# Altium schematic sheet PWR_F2.SchDoc
size A3; Organization: Altium Limited; Address1: L3, 12a Rodborough Rd; Address2: Frenchs Forest; Address3: NSW; Address4: Australia 2086
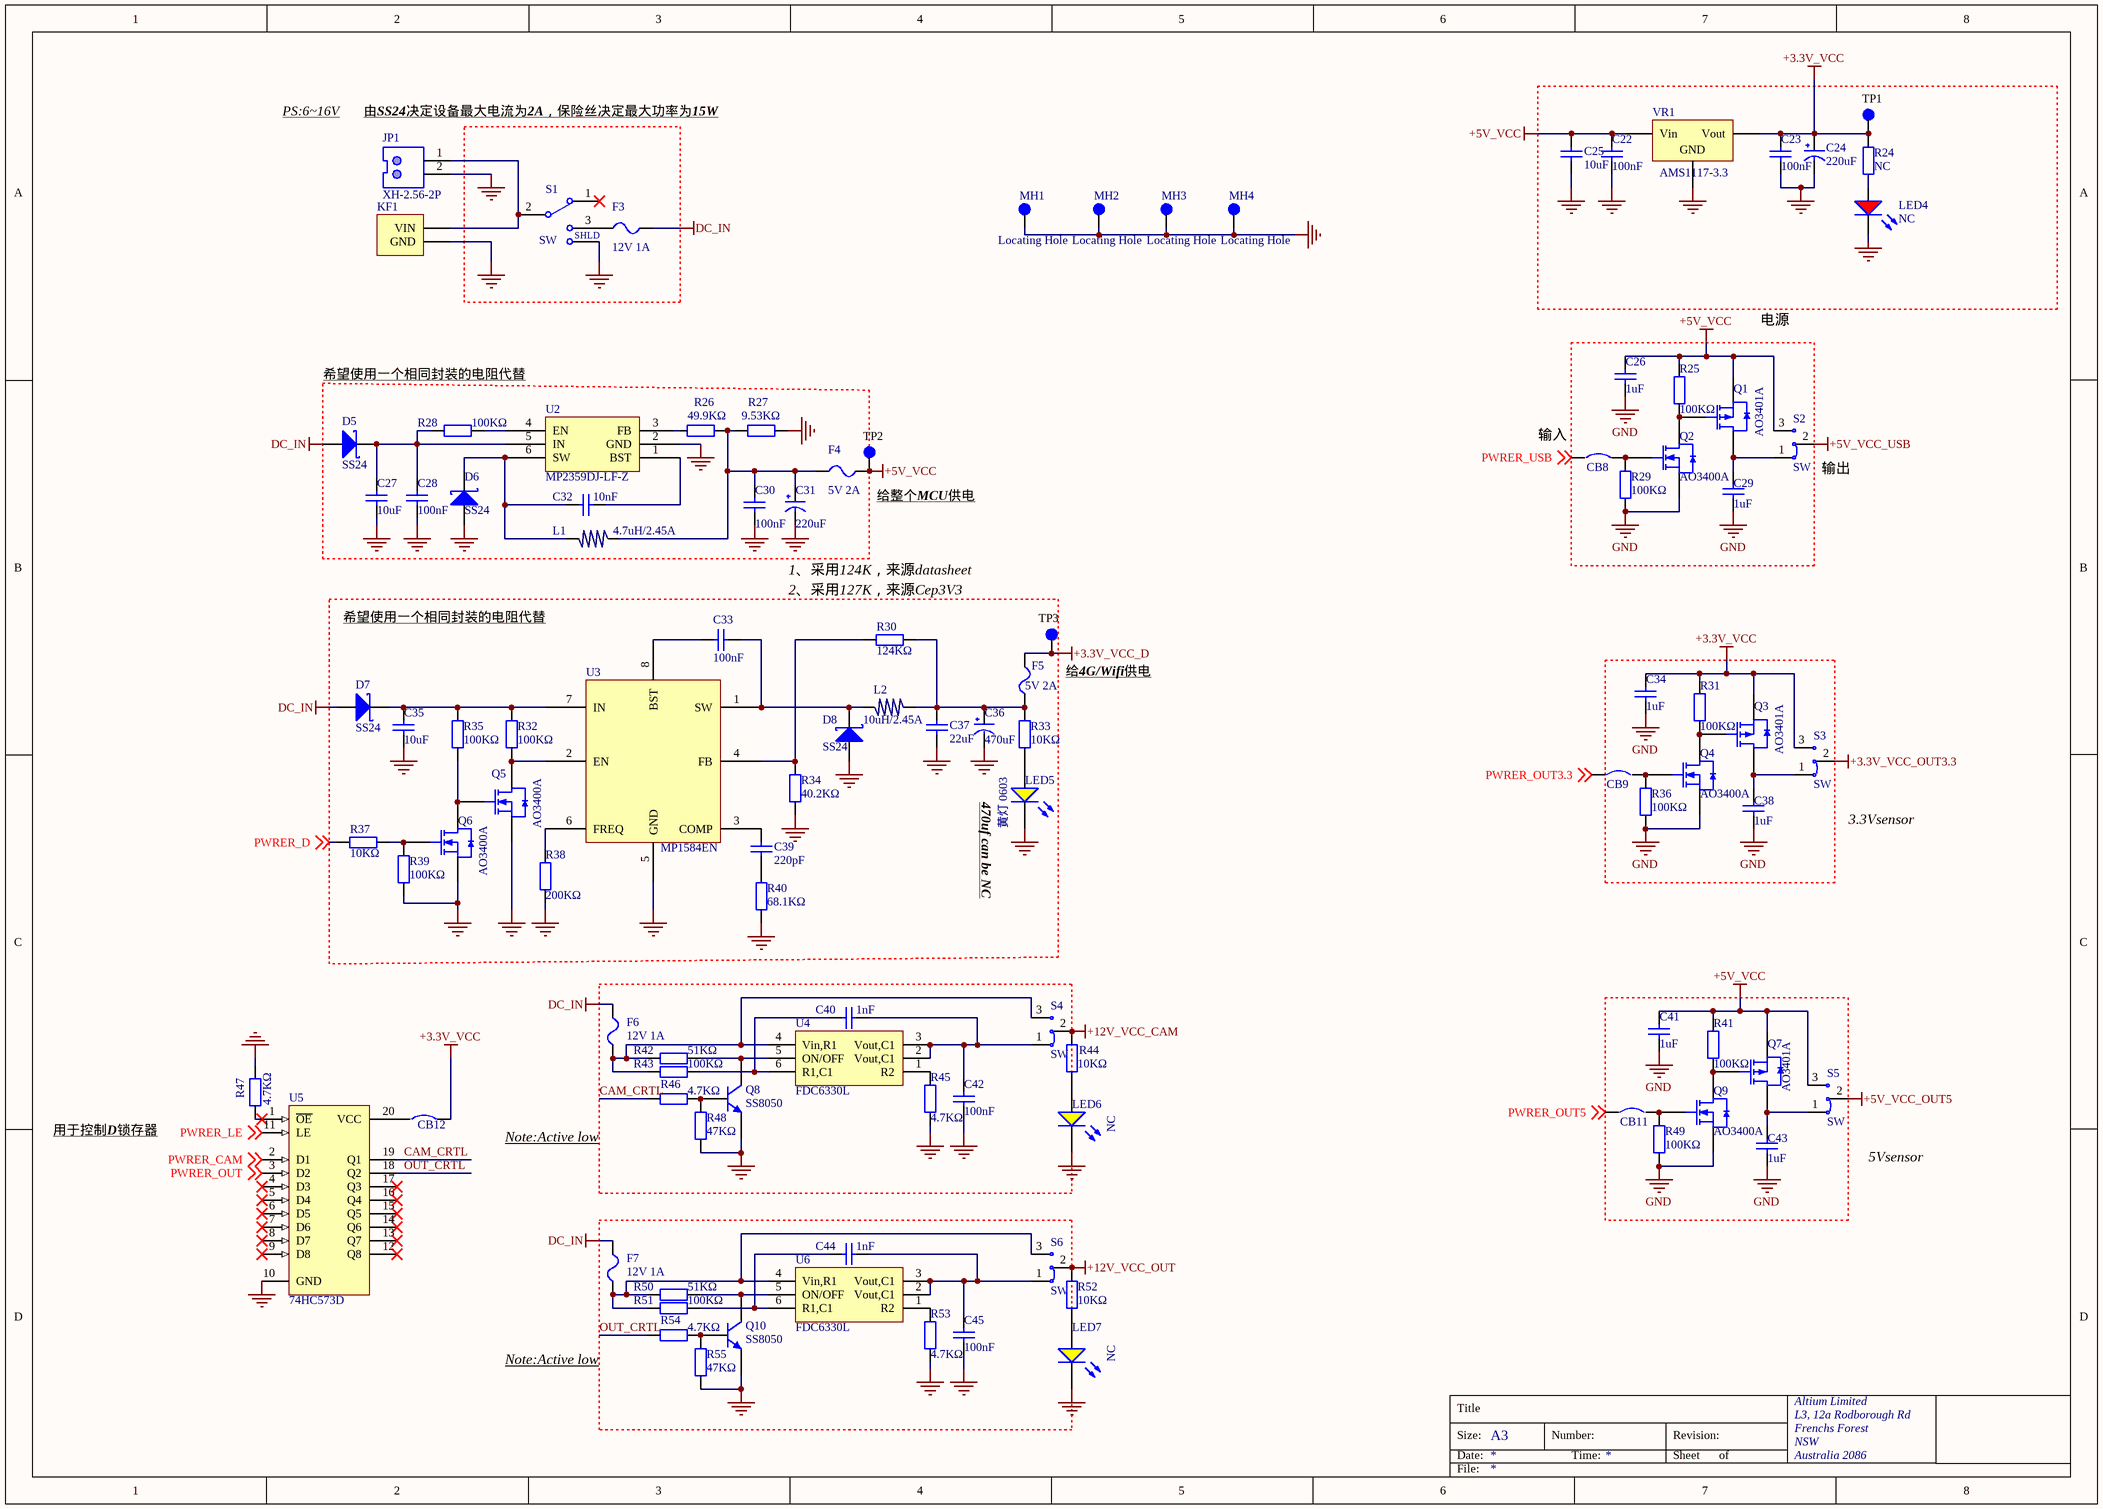
[diagram p0: PWR_F2.SchDoc]

## Parts
C22  100nF  [0603_C]
C23  100nF  [0603_C]
C24  220uF  [CT 6*6 - C]
C25  10uF  [0805_C]
C26  1uF  [0603_C]
C27  10uF  [0805_C]
C28  100nF  [0603_C]
C29  1uF  [0603_C]
C30  100nF  [0603_C]
C31  220uF  [CT 6*6 - C]
C32  10nF  [0603_C]
C33  100nF  [0603_C]
C34  1uF  [0603_C]
C35  10uF  [1206_C]
C36  470uF  [CT 8*7 - C]
C37  22uF  [0805_C]
C38  1uF  [0603_C]
C39  220pF  [0603_C]
C40  1nF  [0603_C]
C41  1uF  [0603_C]
C42  100nF  [0603_C]
C43  1uF  [0603_C]
C44  1nF  [0603_C]
C45  100nF  [0603_C]
CB8  CB  [CW]  (value not drawn)  (no BOM)
CB9  CB  [CW]  (value not drawn)  (no BOM)
CB11  CB  [CW]  (value not drawn)  (no BOM)
CB12  CB  [CW]  (value not drawn)  (no BOM)
D5  SS24  [SMA(DO-214AC)_S1]
D6  SS24  [SMA(DO-214AC)_S1]
D7  SS24  [SMA(DO-214AC)_S1]
D8  SS24  [SMA(DO-214AC)_S1]
F3  12V 1A  [FU 0805]
F4  5V 2A  [FU 0805]
F5  5V 2A  [FU 0805]
F6  12V 1A  [FU 0805]
F7  12V 1A  [FU 0805]
JP1  XH-2.56-2P  [XH2.54-2P]
KF1  DC  [KF2EDGK-2.54-LI-2P]  (value not drawn)
L1  4.7uH/2.45A  [L_0630]
L2  10uH/2.45A  [L_0630]
LED4  NC  [0603_LED_S1]
LED5  黄灯 0603  [0603_LED_S1]
LED6  NC  [0603_LED_S1]
LED7  NC  [0603_LED_S1]
MH1  Locating Hole  [lh]
MH2  Locating Hole  [lh]
MH3  Locating Hole  [lh]
MH4  Locating Hole  [lh]
Q1  AO3401A  [SOT-23-3L]
Q2  AO3400A  [SOT-23-3L]
Q3  AO3401A  [SOT-23-3L]
Q4  AO3400A  [SOT-23-3L]
Q5  AO3400A  [SOT-23-3L]
Q6  AO3400A  [SOT-23-3L]
Q7  AO3401A  [SOT-23-3L]
Q8  SS8050  [SOT-23(SOT-23-3)]
Q9  AO3400A  [SOT-23-3L]
Q10  SS8050  [SOT-23(SOT-23-3)]
R24  NC  [0603_R]
R25  100KΩ  [0603_R]
R26  49.9KΩ  [0603_R]
R27  9.53KΩ  [0603_R]
R28  100KΩ  [0603_R]
R29  100KΩ  [0603_R]
R30  124KΩ  [0603_R]
R31  100KΩ  [0603_R]
R32  100KΩ  [0603_R]
R33  10KΩ  [0402_R]
R34  40.2KΩ  [0603_R]
R35  100KΩ  [0603_R]
R36  100KΩ  [0603_R]
R37  10KΩ  [0603_R]
R38  200KΩ  [0603_R]
R39  100KΩ  [0603_R]
R40  68.1KΩ  [0603_R]
R41  100KΩ  [0603_R]
R42  51KΩ  [0603_R]
R43  100KΩ  [0603_R]
R44  10KΩ  [0603_R]
R45  4.7KΩ  [0603_R]
R46  4.7KΩ  [0603_R]
R47  4.7KΩ  [0603_R]
R48  47KΩ  [0603_R]
R49  100KΩ  [0603_R]
R50  51KΩ  [0603_R]
R51  100KΩ  [0603_R]
R52  10KΩ  [0603_R]
R53  4.7KΩ  [0603_R]
R54  4.7KΩ  [0603_R]
R55  47KΩ  [0603_R]
S1  SW  [SS-12F23 (1P2T)  Straight foot]
S2  SW  [SWITCH_SPOT]
S3  SW  [SWITCH_SPOT]
S4  SW  [SWITCH_SPOT]
S5  SW  [SWITCH_SPOT]
S6  SW  [SWITCH_SPOT]
TP1  TP  [TP-SM-C-100-PIN]  (value not drawn)
TP2  TP  [TP-SM-C-100-PIN]  (value not drawn)
TP3  TP  [TP-SM-C-100-PIN]  (value not drawn)
U2  MP2359DJ-LF-Z  [SOT-23-6]
U3  MP1584EN  [SOIC-8_EP_150mil]
U4  FDC6330L  [SOT-23-6]
U5  74HC573D  [SSOP-20_208mil]
U6  FDC6330L  [SOT-23-6]
VR1  AMS1117-3.3  [SOT-223]

## Blocks framed on the sheet
电源: C26 C29 CB8 Q1 Q2 R25 R29 S2
希望使用一个相同封装的电阻代替: C27 C28 C30-C32 D5 D6 F4 L1 R26-R28 U2
2、采用127K，来源Cep3V3: C33 C35-C37 C39 D7 D8 F5 L2 LED5 Q5 Q6 R30 R32-R35 R37-R40 TP3 U3

## Nets
+3.3V_VCC: C23.2 C24.1(VCC) C34.2 CB12.2 Q3.2(S) R24.2 R31.2 S3.3 TP1.1 VR1.2(Vout)
+3.3V_VCC_D: F5.2 TP3.1
+3.3V_VCC_OUT3.3: S3.2
+5V_VCC: C22.2 C25.2 C26.2 C41.2 F4.2 Q1.2(S) Q7.2(S) R25.2 R41.2 S2.3 S5.3 TP2.1 VR1.3(Vin)
+5V_VCC_OUT5: S5.2
+5V_VCC_USB: S2.2
+12V_VCC_CAM: R44.2 S4.2
+12V_VCC_OUT: R52.2 S6.2
DC_IN: D5.1(A) D7.1(A) F3.2 F6.2 F7.2
GND: C22.1 C23.1 C24.2(GND) C25.1 C26.1 C27.2 C28.1 C29.1 C30.2 C31.2(GND) C34.1 C35.2 C36.2(GND) C37.1 C38.1 C41.1 C42.1 C43.1 C45.1 D6.1(A) D8.1(A) JP1.2 KF1.2(GND) LED4.K LED5.K LED6.K LED7.K MH1.1 MH2.1 MH3.1 MH4.1 Q2.2(S) Q4.2(S) Q5.2(S) Q6.2(S) Q8.2(E) Q9.2(S) Q10.2(E) R27.2 R29.1 R34.1 R36.1 R38.2 R39.1 R40.1 R45.2 R47.2 R48.2 R49.1 R53.2 R55.2 S1.0(shield) U2.2(GND) U3.5(GND) U5.10(GND) VR1.1(GND)
CAM_CRTL: R46.1 U5.19(Q1)
OUT_CRTL: R54.1 U5.18(Q2)
PWRER_CAM: U5.2(D1) ; off-sheet PWRER_CAM
PWRER_D: R37.1 ; off-sheet PWRER_D
PWRER_LE: U5.11(LE) ; off-sheet PWRER_LE
PWRER_OUT: U5.3(D2) ; off-sheet PWRER_OUT
PWRER_OUT3.3: CB9.1 ; off-sheet PWRER_OUT3.3
PWRER_OUT5: CB11.1 ; off-sheet PWRER_OUT5
PWRER_USB: CB8.1 ; off-sheet PWRER_USB
NetC27_1: C27.1 C28.2 D5.2(K) R28.2 U2.5(IN)
NetC29_2: C29.2 Q1.3(D) S2.1
NetC30_1: C30.1 C31.1(VCC) F4.1 L1.1 R26.1 R27.1
NetC32_1: C32.1 U2.1(BST)
NetC32_2: C32.2 D6.2(K) L1.2 U2.6(SW)
NetC33_1: C33.1 U3.8(BST)
NetC33_2: C33.2 D8.2(K) L2.1 U3.1(SW)
NetC35_1: C35.1 D7.2(K) R32.1 R35.1 U3.7(IN)
NetC36_1: C36.1(VCC) C37.2 F5.1 L2.2 R30.2 R33.2
NetC38_2: C38.2 Q3.3(D) S3.1
NetC39_1: C39.1 R40.2
NetC39_2: C39.2 U3.3(COMP)
NetC40_1: C40.1 C42.2 S4.1 U4.2(Vout,C1) U4.3(Vout,C1)
NetC40_2: C40.2 R43.1 U4.6(R1,C1)
NetC43_2: C43.2 Q7.3(D) S5.1
NetC44_1: C44.1 C45.2 S6.1 U6.2(Vout,C1) U6.3(Vout,C1)
NetC44_2: C44.2 R51.1 U6.6(R1,C1)
NetCB8_2: CB8.2 Q2.1(G) R29.2
NetCB9_2: CB9.2 Q4.1(G) R36.2
NetCB11_2: CB11.2 Q9.1(G) R49.2
NetCB12_1: CB12.1 U5.20(VCC)
NetF3_1: F3.1 S1.3
NetF6_1: F6.1 R42.2 R43.2 S4.3 U4.4(Vin,R1)
NetF7_1: F7.1 R50.2 R51.2 S6.3 U6.4(Vin,R1)
NetJP1_1: JP1.1 KF1.1(VIN) S1.2
NetLED4_A: LED4.A R24.1
NetLED5_A: LED5.A R33.1
NetLED6_A: LED6.A R44.1
NetLED7_A: LED7.A R52.1
NetQ1_1: Q1.1(G) Q2.3(D) R25.1
NetQ3_1: Q3.1(G) Q4.3(D) R31.1
NetQ5_1: Q5.1(G) Q6.3(D) R35.2
NetQ5_3: Q5.3(D) R32.2 U3.2(EN)
NetQ6_1: Q6.1(G) R37.2 R39.2
NetQ7_1: Q7.1(G) Q9.3(D) R41.1
NetQ8_1: Q8.1(B) R46.2 R48.1
NetQ8_3: Q8.3(C) R42.1 U4.5(ON/OFF)
NetQ10_1: Q10.1(B) R54.2 R55.1
NetQ10_3: Q10.3(C) R50.1 U6.5(ON/OFF)
NetR26_2: R26.2 U2.3(FB)
NetR28_1: R28.1 U2.4(EN)
NetR30_1: R30.1 R34.2 U3.4(FB)
NetR38_1: R38.1 U3.6(FREQ)
NetR45_1: R45.1 U4.1(R2)
NetR47_1: R47.1 U5.1(~{OE})
NetR53_1: R53.1 U6.1(R2)

Not connected (* = marked no-connect by the designer): S1 1*; U5 4(D3)* 5(D4)* 6(D5)* 7(D6)* 8(D7)* 9(D8)* 12(Q8)* 13(Q7)* 14(Q6)* 15(Q5)* 16(Q4)* 17(Q3)*

## Notes on the sheet
- PS:6~16V
- (near JP1) 由SS24决定设备最大电流为2A，保险丝决定最大功率为15W
- (near CB8) 输入
- 给整个MCU供电
- (near S2) 输出
- 1、采用124K，来源datasheet
- 希望使用一个相同封装的电阻代替
- 给4G/Wifi供电
- (near LED5) 470uf can be NC
- (near S3) 3.3Vsensor
- 用于控制D锁存器
- Note:Active low
- 5Vsensor
- Title
- Size:
- Date:
- A3
- Number:
- Time:
- Revision:
- Sheet
- of
- File:
- *
- (in symbol SW SSW-1P_2) SHLD

## Library data of the parts
C22 C23 C28 C30 C33 C42 C45 = Cap 0603 100nF (104) 10% 50V: 贴片电容; ComponentLink1Description: 供应商链接; ComponentLink1URL: http://www.szlcsc.com/product/details_15331.html; Package: 0603; Supplier: LC; SuppliersPartNumber: C14663
C24 C31 = Cap+ CT6.3*5.4 220uF/16V: 电解电容
C25 C27 = Cap 0805 10uF (106) 10% 25V: 贴片电容; ComponentLink1Description: 供应商链接; ComponentLink1URL: http://www.szlcsc.com/product/details_16532.html; Package: 0805; Supplier: LC; SuppliersPartNumber: C15850; Value: 10uF
C26 C29 C34 C38 C41 C43 = Cap 0603 1uF (105) 10% 50V: 贴片电容; ComponentLink1Description: 供应商链接; ComponentLink1URL: http://www.szlcsc.com/product/details_16531.html; Package: 0603; Supplier: LC; SuppliersPartNumber: C15849
C32 = Cap 0603 10nF (103) 10% 50V: 贴片电容; ComponentLink1Description: 供应商链接; ComponentLink1URL: http://www.szlcsc.com/product/details_58143.html; Package: 0603; Supplier: LC; SuppliersPartNumber: C57112
C35 = Cap 1206 10uF (106) 10% 50V: 贴片电容; ComponentLink1Description: 供应商链接; ComponentLink1URL: http://www.szlcsc.com/product/details_14236.html; Package: 1206; Supplier: LC; SuppliersPartNumber: C13585
C36 = Cap+ CT8*10.2 470uF/16V: 电解电容
C37 = Cap 0805 22uF (226) 20% 25V: 贴片电容; ComponentLink1Description: 供应商链接; ComponentLink1URL: http://www.szlcsc.com/product/details_46786.html; Package: 0805; Supplier: LC; SuppliersPartNumber: C45783
C39 = Cap 0603 220pF (221) 10% 50V: 贴片电容; ComponentLink1Description: 供应商链接; ComponentLink1URL: http://www.szlcsc.com/product/details_1955.html; Package: 0603; Supplier: LC; SuppliersPartNumber: C1603
C40 C44 = Cap 0603 1nF (102) 10% 50V: 贴片电容; ComponentLink1Description: 供应商链接; ComponentLink1URL: http://www.szlcsc.com/product/details_1940.html; Package: 0603; Supplier: LC; SuppliersPartNumber: C1588
CB8 CB9 CB11 CB12 = Circuit Breaker: Published: 24-Mar-1999; LatestRevisionDate: 17-Jul-2002; LatestRevisionNote: Re-released for DXP Platform.; PackageReference: SPST-2; Publisher: Altium Limited
D5-D8 = SMA(DO-214AC) SS24: 肖特基二极管; ComponentLink1Description: 供应商链接; ComponentLink1URL: http://www.szlcsc.com/product/details_23178.html; Package: SMA(DO-214AC); Supplier: LC; SuppliersPartNumber: C22452
F3 F6 F7 = FU PPTC MSMD 12V 1A: 自恢复保险丝; BOM名称: 贴片保险丝; 版权归属: 源创客; 学习资源: www.ooocke.com
F4 F5 = FU PPTC MSMD 5V 2A: 自恢复保险丝; BOM名称: 贴片保险丝; 版权归属: 源创客; 学习资源: www.ooocke.com
JP1 = Header XH-2.56-2P: Male Header, Pitch 2.5 mm, 1 x 2 Position, Height 7 mm, Tail Length 3.4 mm, -25 to 85 degC, RoHS, Bulk; Manufacturer: JST; No of Positions: 2; Pitch: 2.5mm; Style/Orientation: StraightHeader/Plug; Datasheet Version: 05/2016; Package Description: Male Header, Pitch 2.5 mm, 1 x 2 Position, Height 7 mm, Tail Length 3.4 mm; Package Reference: B2B-XH-A; Mounting Technology: ThroughHole; Type: ShroudedHeader; Datasheet URL: http://www.jst-mfg.com/product/pdf/eng/eXH.pdf; Manufacturer URL: http://www.jst.com/home2.html; Termination: Crimp
KF1 = KF2EDGK-2.54-2P: 2P, DC,KF2EDGK-2.54
L1 = IUD 0630-4.7uH/2.45A 10%: 一体成型贴片电感; Value: 10uH/2.45A; ComponentLink1Description: 供应商链接; ComponentLink1URL: http://www.szlcsc.com/product/details_12684.html
L2 = IUD 0630-10uH/2.45A 10%: 一体成型贴片电感; ComponentLink1Description: 供应商链接; ComponentLink1URL: http://www.szlcsc.com/product/details_12684.html; Value: 10uH/2.45A
LED4 = LED 0603 红灯: 发光二极管; ComponentLink1Description: 供应商链接; ComponentLink1URL: http://www.szlcsc.com/product/details_2659.html; Package: 0603; Supplier: LC; SuppliersPartNumber: C2286
LED5-LED7 = LED 0603 黄灯: 发光二极管; ComponentLink1Description: 供应商链接; ComponentLink1URL: http://www.szlcsc.com/product/details_73147.html; Package: 0603; Supplier: LC; SuppliersPartNumber: C72038
MH1-MH4 = LocatingHole
Q1 Q3 Q7 = PMOS SOT-23 AO3401A X13A15 : MOS(场效应管) PMOS; ComponentLink1Description: 供应商链接; ComponentLink1URL: http://www.szlcsc.com/product/details_15801.html; Package: SOT-23; Supplier: LC; SuppliersPartNumber: C15127
Q2 Q4-Q6 Q9 = NMOS SOT-23 AO3400A X0YV1T: MOS(场效应管) NMOS; ComponentLink1Description: 供应商链接; ComponentLink1URL: http://www.szlcsc.com/product/details_21629.html; Package: SOT-23; Supplier: LC; SuppliersPartNumber: C20917
Q8 Q10 = NPN SOT-23 SS8050 Y1: NPN 三极管; ComponentLink1Description: 供应商链接; ComponentLink1URL: http://www.szlcsc.com/product/details_2507.html; Package: SOT-23; Supplier: LC; SuppliersPartNumber: C2150
R24 R45-R47 R53 R54 = Res 0603 4.7KΩ (4701) 1%: 贴片电阻; ComponentLink1Description: 供应商链接; ComponentLink1URL: http://www.szlcsc.com/product/details_23889.html; Package: 0603; Supplier: LC; SuppliersPartNumber: C23162
R25 R28 R29 R31 R32 R35 R36 R39 R41 R43 R49 R51 = Res 0603 100KΩ (1003) 1%: 贴片电阻; ComponentLink1Description: 供应商链接; ComponentLink1URL: http://www.szlcsc.com/product/details_26546.html; Package: 0603; Supplier: LC; SuppliersPartNumber: C25803
R26 = Res 0603 49.9KΩ (4992) 1%: 贴片电阻; ComponentLink1Description: 供应商链接; ComponentLink1URL: http://www.szlcsc.com/product/details_23911.html; Package: 0603; Supplier: LC; SuppliersPartNumber: C23184
R27 = Res 0603 9.53KΩ (95B) 1%: 贴片电阻; ComponentLink1Description: 供应商链接; ComponentLink1URL: http://www.szlcsc.com/product/details_23886.html; Package: 0603; Supplier: LC; SuppliersPartNumber: C23159
R30 = Res 0603 124KΩ 1%: 贴片电阻; ComponentLink1Description: 供应商链接; ComponentLink1URL: http://www.szlcsc.com/product/details_23702.html; Package: 0603; Supplier: LC; SuppliersPartNumber: C22975
R33 = Res 0402 10KΩ (1002) 1%: 贴片电阻; ComponentLink1Description: 供应商链接; ComponentLink1URL: http://www.szlcsc.com/product/details_26487.html; Package: 0402; Supplier: LC; SuppliersPartNumber: C25744; Value: 10KΩ
R34 = Res 0603 40.2KΩ 1%: 贴片电阻; ComponentLink1Description: 供应商链接; ComponentLink1URL: http://www.szlcsc.com/product/details_23702.html; Package: 0603; Supplier: LC; SuppliersPartNumber: C22975
R37 R44 R52 = Res 0603 10KΩ (1002) 1%: 贴片电阻; ComponentLink1Description: 供应商链接; ComponentLink1URL: http://www.szlcsc.com/product/details_26547.html; Package: 0603; Supplier: LC; SuppliersPartNumber: C25804
R38 = Res 0603 200KΩ (2003) 1%: 贴片电阻; ComponentLink1Description: 供应商链接; ComponentLink1URL: http://www.szlcsc.com/product/details_26554.html; Package: 0603; Supplier: LC; SuppliersPartNumber: C25811
R40 = Res 0603 68.1KΩ 1%: 贴片电阻; ComponentLink1Description: 供应商链接; ComponentLink1URL: http://www.szlcsc.com/product/details_23702.html; Package: 0603; Supplier: LC; SuppliersPartNumber: C22975
R42 R50 = Res 0603 51KΩ (5102) 1%: 贴片电阻; ComponentLink1Description: 供应商链接; ComponentLink1URL: http://www.szlcsc.com/product/details_23923.html; Package: 0603; Supplier: LC; SuppliersPartNumber: C23196
R48 R55 = Res 0603 47KΩ (4702) 1%: 贴片电阻; ComponentLink1Description: 供应商链接; ComponentLink1URL: http://www.szlcsc.com/product/details_26562.html; Package: 0603; Supplier: LC; SuppliersPartNumber: C25819
S1 = SW SSW-1P_2: 1路波动开关; BOM名称: 波动开关; 版权归属: 源创客; 学习资源: www.ooocke.com
S2-S6 = SW SPOT_SW-1P: 1路开关; BOM名称: 波动开关; 版权归属: 源创客; 学习资源: www.ooocke.com
TP1-TP3 = TP-SM-C100-PIN: Test Point, Surface Mount, Circular, Pad Diameter 1.27 mm; ComponentLink2URL: http://www.keyelco.com/product-pdf.cfm?p=1320; ComponentLink1URL: http://www.keyelco.com/; ComponentLink1Description: Manufacturer URL; ComponentLink2Description: Datasheet
U2 = MP2359DJ-LF-Z_[C14259]: DC-DC芯片; ComponentLink1Description: 供应商链接; ComponentLink1URL: http://www.szlcsc.com/product/details_14917.html; Package: SOT-23-6; Supplier: LC; SuppliersPartNumber: C14259
U3 = MP1584EN-LF-Z_[C15051]: DC-DC芯片; ComponentLink1Description: 供应商链接; ComponentLink1URL: http://www.szlcsc.com/product/details_15724.html; Package: SOIC-8_EP_150mil; Supplier: LC; SuppliersPartNumber: C15051
U4 U6 = FDC6330L: Integrated Load Switch, 3 to 20 V, -55 to 150 degC, 6-Pin SOT23, RoHS, Tape and Reel, CMP-2000-04940-1; Manufacturer: Fairchild; Load Pulsed Current: 10A; Uni / Bi Directional Polarity: NP; No. of Outputs: 1; On / Enable Input Polarity: ActiveHigh; SMD Marking: 3544916; Power Dissipation Ptot Max: 0.7W; Continuous Drain Current Id: 2.3A; No. of Pins: 6; Protection Type: Yes; Power Load Switch Type: HighSide; Current Limit: 2.5A; Voltage Drop @ Vin 12V: 0.2V; Input Voltage Max: 20V; Transistor Polarity: NandPComplement; On State Resistance: 0.054ohm; Package Version: Rev. 5, 05/2015; On Resistance Rds(on): 0.08ohm; Voltage Off: 8V; No. of Transistors: 2; SVHC: NoSVHC(19-Dec-2012); Voltage In Min: 3V; Transistor Type: MOSFET; Operating Temperature Max: 150degC; Manufacturer URL: https://www.fairchildsemi.com/; Power Dissipation Pd: 0.7W; Package / Case: SuperSOT-6; Package URL: https://www.fairchildsemi.com/package-drawings/MA/MA06A.pdf; Datasheet URL: https://datasheet.ciiva.com/1572/276121-1572006.pdf; Package Reference: SOT23-6; Operating Temperature Range: -55degCto+150degC; Operating Temperature Min: -55degC; Drain Source Voltage Vds: 20V; Cont Load Current: 2.3A; Internal Switch: Yes; Voltage In Max: 20V; Distribution Switch Case Style: SSOT; Output Current Max: 10A; Input Voltage: 20V; Datasheet Version: Rev. C, 02/1999; Thermal Protection: Yes; Package Description: 6-Pin Small Outline Transistor, Body 2.9 x 1.6 mm, Pitch 0.95 mm; Pulse Current Idm: 10A
U5 = 74HC573D_[C5608]: 74系列逻辑芯片; ComponentLink1Description: 供应商链接; ComponentLink1URL: http://www.szlcsc.com/product/details_6059.html; Package: SOIC-20_300mil; Supplier: LC; SuppliersPartNumber: C5608
VR1 = SOT-223 AMS1117-3.3: 低压差线性稳压(LDO); ComponentLink1Description: 供应商链接; ComponentLink1URL: http://www.szlcsc.com/product/details_6652.html; Package: SOT-223; Supplier: LC; SuppliersPartNumber: C6186